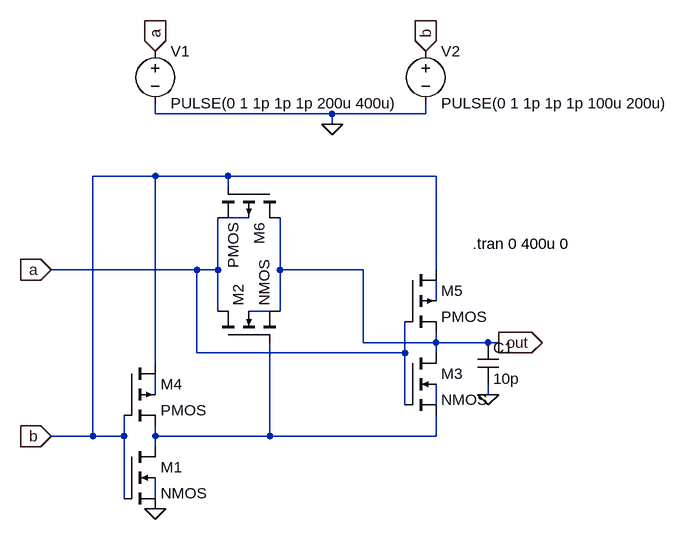
[diagram p0: schematic XOR_using_TG vani.asc]
XOR_using_TG vani.asc, the LTspice schematic file:
Version 4
SHEET 1 2040 3628
WIRE 80 -224 80 -240
WIRE 352 -224 80 -224
WIRE 496 -224 496 -240
WIRE 496 -224 352 -224
WIRE 352 -208 352 -224
WIRE 80 -128 -16 -128
WIRE 192 -128 80 -128
WIRE 512 -128 192 -128
WIRE 192 -112 192 -128
WIRE 224 -64 192 -64
WIRE 144 16 -80 16
WIRE 176 16 176 -64
WIRE 176 16 144 16
WIRE 272 16 272 -64
WIRE 400 16 272 16
WIRE 512 16 512 -128
WIRE 512 64 512 32
WIRE 176 80 176 16
WIRE 256 80 224 80
WIRE 272 80 272 16
WIRE 400 128 400 16
WIRE 512 128 512 112
WIRE 512 128 400 128
WIRE 592 128 512 128
WIRE 608 128 592 128
WIRE 144 144 144 16
WIRE 464 144 464 96
WIRE 464 144 144 144
WIRE 512 144 512 128
WIRE 80 160 80 -128
WIRE 80 208 80 176
WIRE 592 208 592 192
WIRE 464 224 464 144
WIRE 512 224 512 192
WIRE -16 272 -16 -128
WIRE -16 272 -80 272
WIRE 32 272 32 240
WIRE 32 272 -16 272
WIRE 80 272 80 256
WIRE 256 272 256 128
WIRE 256 272 80 272
WIRE 512 272 512 240
WIRE 512 272 256 272
WIRE 80 288 80 272
WIRE 32 368 32 272
WIRE 80 368 80 336
FLAG 80 384 0
FLAG 352 -208 0
FLAG 80 -320 a
IOPIN 80 -320 In
FLAG 496 -320 b
IOPIN 496 -320 In
FLAG -80 16 a
IOPIN -80 16 In
FLAG -80 272 b
IOPIN -80 272 In
FLAG 608 128 out
IOPIN 608 128 Out
FLAG 592 208 0
SYMBOL nmos4 32 288 R0
SYMATTR InstName M1
SYMATTR Value2 l=90n w=900n
SYMBOL nmos4 176 128 R270
SYMATTR InstName M2
SYMATTR Value2 l=90n w=900n
SYMBOL nmos4 464 144 R0
SYMATTR InstName M3
SYMATTR Value2 l=90n w=900n
SYMBOL pmos4 32 160 R0
SYMATTR InstName M4
SYMATTR Value2 l=90n w=1.8u
SYMBOL pmos4 464 16 R0
SYMATTR InstName M5
SYMATTR Value2 l=90n w=1.8u
SYMBOL pmos4 272 -112 R90
SYMATTR InstName M6
SYMATTR Value2 l=90n w=1.8u
SYMBOL voltage 80 -336 R0
WINDOW 123 0 0 Left 0
WINDOW 39 0 0 Left 0
SYMATTR InstName V1
SYMATTR Value PULSE(0 1 1p 1p 1p 200u 400u)
SYMBOL voltage 496 -336 R0
WINDOW 123 0 0 Left 0
WINDOW 39 0 0 Left 0
SYMATTR InstName V2
SYMATTR Value PULSE(0 1 1p 1p 1p 100u 200u)
SYMBOL cap 576 128 R0
SYMATTR InstName C1
SYMATTR Value 10p
TEXT 568 -24 Left 2 !.tran 0 400u 0

The netlist it stands for:
* XOR_using_TG vani.asc
M1 N006 b 0 N007 NMOS l=90n w=900n
M2 a N006 out N003 NMOS l=90n w=900n
M3 out a N006 N005 NMOS l=90n w=900n
M4 b b N006 N004 PMOS l=90n w=1.8u
M5 b a out N002 PMOS l=90n w=1.8u
M6 out b a N001 PMOS l=90n w=1.8u
V1 a 0 PULSE(0 1 1p 1p 1p 200u 400u)
V2 b 0 PULSE(0 1 1p 1p 1p 100u 200u)
C1 out 0 10p
.model NMOS NMOS
.model PMOS PMOS
.lib standard.mos
.tran 0 400u 0
.backanno
.end